# EAGLE design electronics (EAGLE 8.7.1)
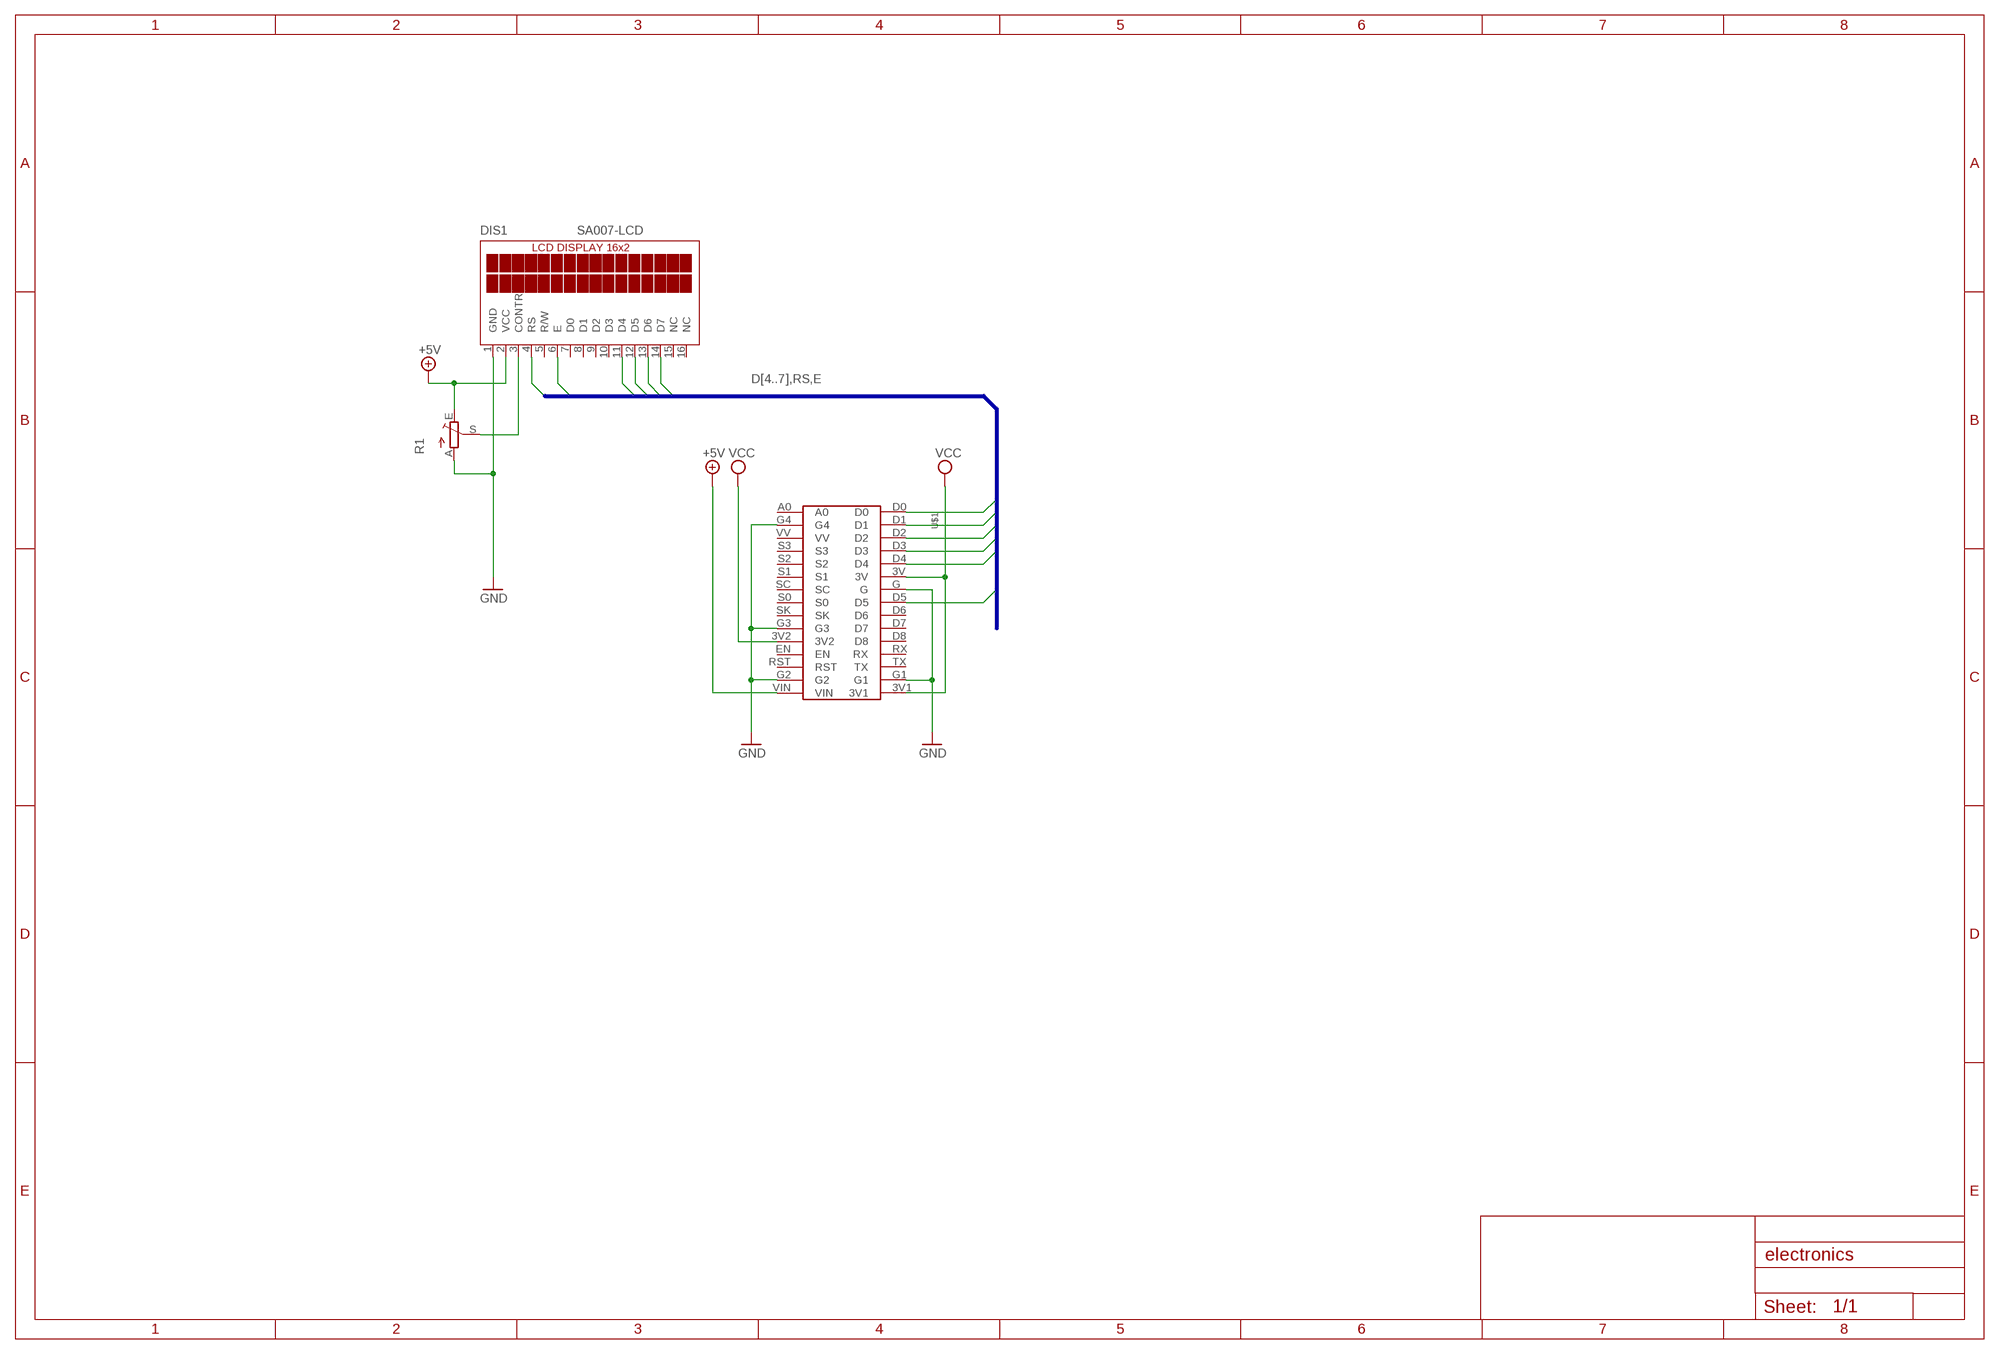
[diagram p0: schematic, sheet 1]

## Parts
DIS1  SA007-LCD  [SA007-LCD]
R1  TRIM_EU-CA9H  [CA9H]
U$1  LOLIN  [LOLIN]

## Nets
+5V: DIS1.2(VCC) R1.E U$1.VIN
D4: DIS1.11(D4) U$1.D0
D5: DIS1.12(D5) U$1.D1
D6: DIS1.13(D6) U$1.D2
D7: DIS1.14(D7) U$1.D3
E: DIS1.6(E) U$1.D5
GND: DIS1.1(GND) R1.A U$1.G U$1.G1 U$1.G2 U$1.G3 U$1.G4
N$2: DIS1.3(CONTR) R1.S
RS: DIS1.4(RS) U$1.D4
VCC: U$1.3V U$1.3V1 U$1.3V2
Unconnected: DIS1.5(R/W) DIS1.7(D0) DIS1.8(D1) DIS1.9(D2) DIS1.10(D3) DIS1.15(NC) DIS1.16(NC) U$1.A0 U$1.D6 U$1.D7 U$1.D8 U$1.EN U$1.RST U$1.RX U$1.S0 U$1.S1 U$1.S2 U$1.S3 U$1.SC U$1.SK U$1.TX U$1.VV

## Buses
D[4..7],RS,E

## Library data of the parts
DIS1 = sa007-lcd:SA007-LCD
R1 = pot:TRIM_EU-: POTENTIOMETER
U$1 = Lolin:LOLIN

## Board
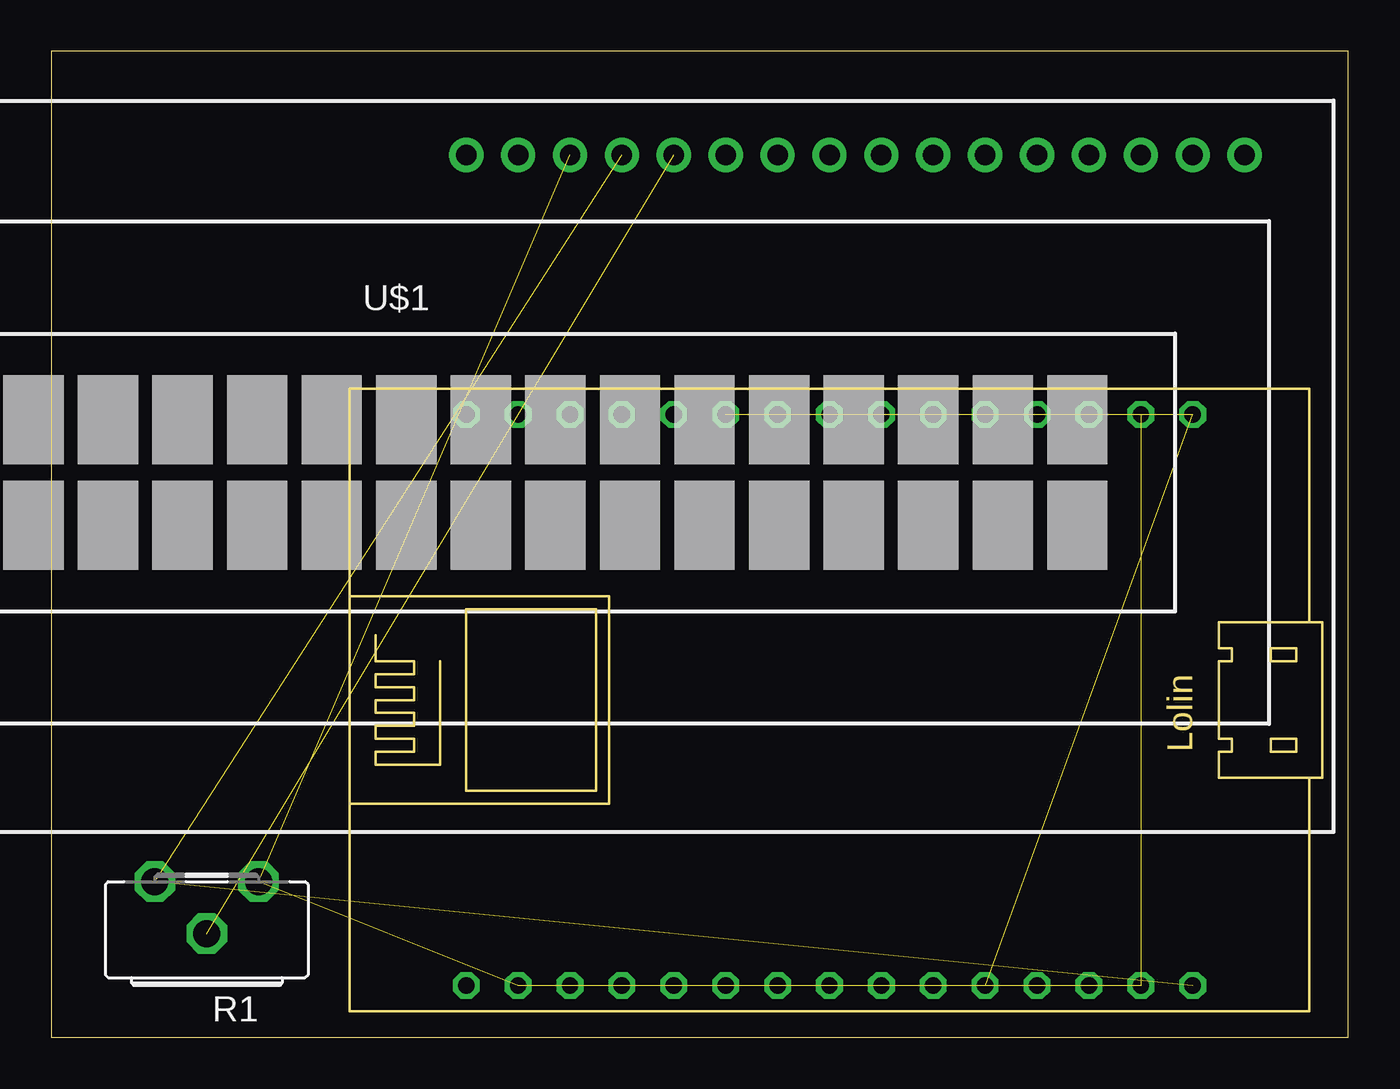
[diagram p1: board, top side]
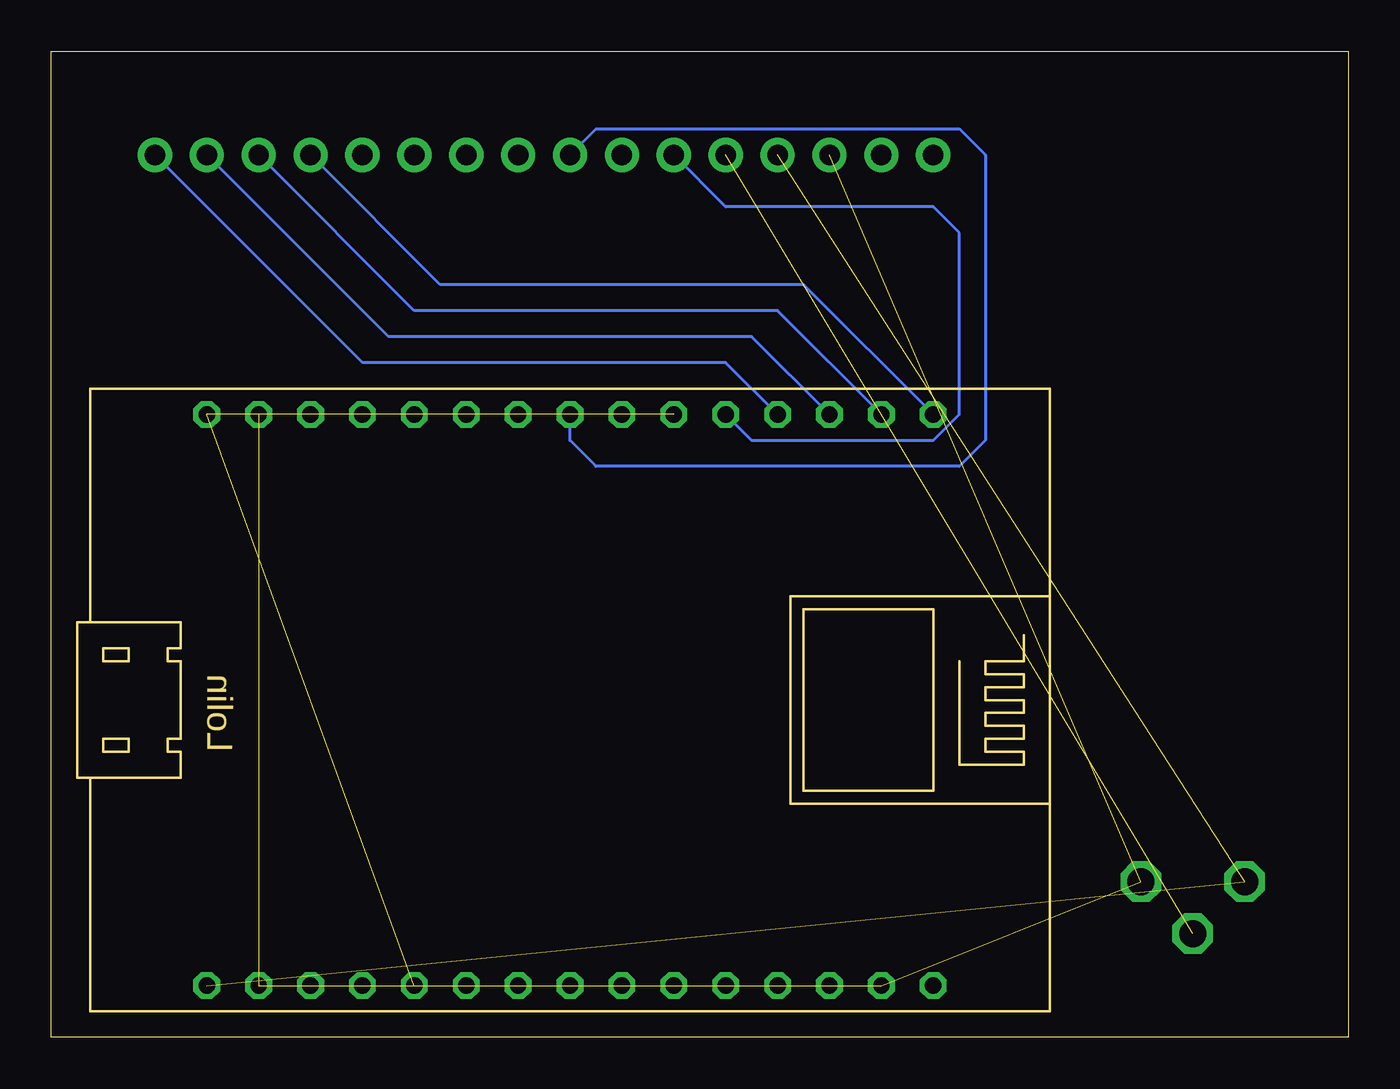
[diagram p2: board, bottom side, seen from below]

Size 63.5 x 48.26 mm. Coordinates in mm from the lower left corner, seen from the top.
Outline: 0,0 63.5,0 63.5,48.26 0,48.26 0,0
Copper layers (1*16): Top 0.035mm / dielectric 1.5mm / Bottom 0.035mm
Design rules "default": minimum track width 6mil, minimum drill 0.35mm, track to track 6mil, track to pad 6mil, pad to pad 6mil, via to via 6mil, smd to smd 6mil, copper to edge 40mil, drill to drill 6mil, minimum pad ring 10mil, minimum via ring 8mil, stop-mask expansion 4mil, vias tented up to drill 0mil, thermal gap 10mil

### Footprints (pad centres in the part's own frame; a part is rotated, then mirrored left to right if it is on the bottom)
SA007-LCD = drill 1 pad 1.676: 1 2.54,12.7; 2 5.08,12.7; 3 7.62,12.7; 4 10.16,12.7; 5 12.7,12.7; 6 15.24,12.7; 7 17.78,12.7; 8 20.32,12.7; 9 22.86,12.7; 10 25.4,12.7; 11 27.94,12.7; 12 30.48,12.7; 13 33.02,12.7; 14 35.56,12.7; 15 -2.54,12.7; 16 0,12.7
CA9H = drill 1.321 octagon: A -2.54,0; E 2.54,0; S 0,2.54
LOLIN = drill 0.8 octagon: 3V -6.35,13.97; 3V1 16.51,13.97; 3V2 6.35,-13.97; A0 -19.05,-13.97; D0 -19.05,13.97; D1 -16.51,13.97; D2 -13.97,13.97; D3 -11.43,13.97; D4 -8.89,13.97; D5 -1.27,13.97; D6 1.27,13.97; D7 3.81,13.97; D8 6.35,13.97; EN 8.89,-13.97; G -3.81,13.97; G1 13.97,13.97; G2 13.97,-13.97; G3 3.81,-13.97; G4 -16.51,-13.97; RST 11.43,-13.97; RX 8.89,13.97; S0 -1.27,-13.97; S1 -6.35,-13.97; S2 -8.89,-13.97; S3 -11.43,-13.97; SC -3.81,-13.97; SK 1.27,-13.97; TX 11.43,13.97; VIN 16.51,-13.97; VV -13.97,-13.97

### Placement (x,y rotation side)
DIS1  22.86,30.48 0 top
R1  7.62,7.62 180 top
U$1  39.37,16.51 0 top

### Tracks (layer width: path | path; a pad name or v marks a point on that pad's centre or on a via)
+5V  (2 unrouted)
D4
  Bottom 0.152: U$1.D0 26.67,36.83 44.45,36.83 DIS1.11
D5
  Bottom 0.152: U$1.D1 27.94,35.56 45.72,35.56 DIS1.12
D6
  Bottom 0.152: U$1.D2 29.21,34.29 46.99,34.29 DIS1.13
D7
  Bottom 0.152: 27.94,30.59 U$1.D3 30.48,33.02 48.26,33.02 DIS1.14
E
  Bottom 0.152: DIS1.6 36.83,44.45 19.05,44.45 17.78,43.18 17.78,29.21 19.05,27.94 36.83,27.94 38.1,29.21 U$1.D5
GND  (6 unrouted)
N$2  (1 unrouted)
RS
  Bottom 0.152: U$1.D4 29.21,29.21 20.32,29.21 19.05,30.48 19.05,39.37 20.32,40.64 30.48,40.64 DIS1.4
VCC  (2 unrouted)